# Altium schematic sheet 05_LEDs.SchDoc: ECE315 Analog
size A; Date: 4/25/2017; ApprovedBy: JSK; CheckedBy: JSK; Author: JSK; CompanyName: University of Wisconsin; DrawnBy: JSK; Engineer: JSK; Organization: ECE 315; Address1: College of Engineering; Address2: 1415 Engineering Drive; Address3: Madison, WI 53706; Address4: ECE 315 Fall 2017; Revision: A; SheetNumber: 2; SheetTotal: 2; AssemblyNumber: 0; MachineName: ECE315-S19; PCBNumber: 001; ApprovedDate: 1/17/2019
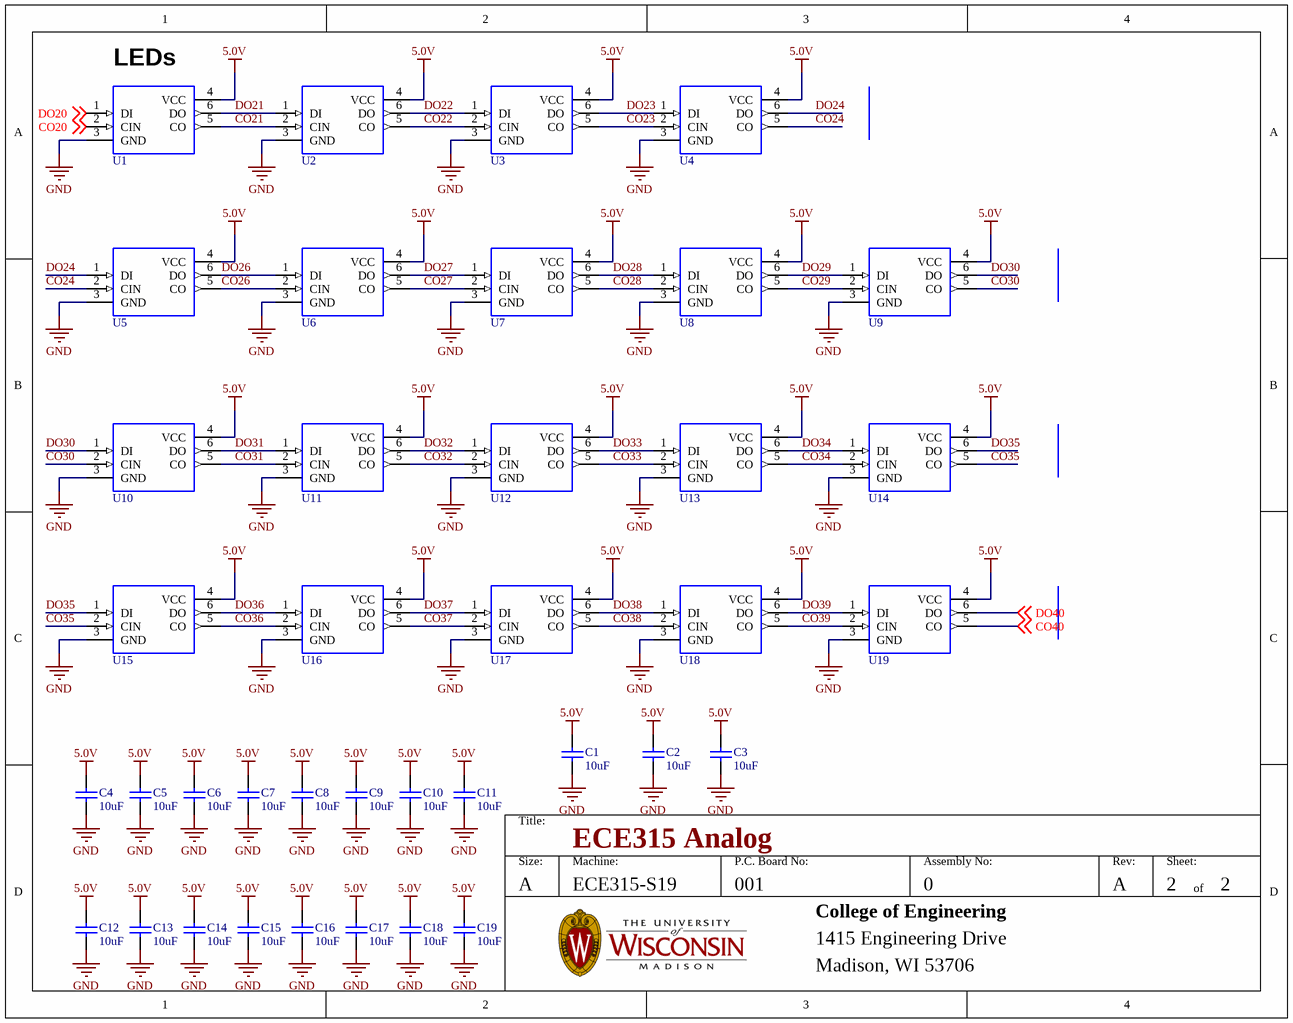
[diagram p0: 05_LEDs.SchDoc]

## Parts
C1  10uF  [CAP_0805]
C2  10uF  [CAP_0805]
C3  10uF  [CAP_0805]
C4  10uF  [CAP_0805]
C5  10uF  [CAP_0805]
C6  10uF  [CAP_0805]
C7  10uF  [CAP_0805]
C8  10uF  [CAP_0805]
C9  10uF  [CAP_0805]
C10  10uF  [CAP_0805]
C11  10uF  [CAP_0805]
C12  10uF  [CAP_0805]
C13  10uF  [CAP_0805]
C14  10uF  [CAP_0805]
C15  10uF  [CAP_0805]
C16  10uF  [CAP_0805]
C17  10uF  [CAP_0805]
C18  10uF  [CAP_0805]
C19  10uF  [CAP_0805]
U1  IC_APA102C  [APA102C]  (value not drawn)
U2  IC_APA102C  [APA102C]  (value not drawn)
U3  IC_APA102C  [APA102C]  (value not drawn)
U4  IC_APA102C  [APA102C]  (value not drawn)
U5  IC_APA102C  [APA102C]  (value not drawn)
U6  IC_APA102C  [APA102C]  (value not drawn)
U7  IC_APA102C  [APA102C]  (value not drawn)
U8  IC_APA102C  [APA102C]  (value not drawn)
U9  IC_APA102C  [APA102C]  (value not drawn)
U10  IC_APA102C  [APA102C]  (value not drawn)
U11  IC_APA102C  [APA102C]  (value not drawn)
U12  IC_APA102C  [APA102C]  (value not drawn)
U13  IC_APA102C  [APA102C]  (value not drawn)
U14  IC_APA102C  [APA102C]  (value not drawn)
U15  IC_APA102C  [APA102C]  (value not drawn)
U16  IC_APA102C  [APA102C]  (value not drawn)
U17  IC_APA102C  [APA102C]  (value not drawn)
U18  IC_APA102C  [APA102C]  (value not drawn)
U19  IC_APA102C  [APA102C]  (value not drawn)

## Nets
5.0V: C1.2 C2.2 C3.2 C4.2 C5.2 C6.2 C7.2 C8.2 C9.2 C10.2 C11.2 C12.2 C13.2 C14.2 C15.2 C16.2 C17.2 C18.2 C19.2 U1.4(VCC) U2.4(VCC) U3.4(VCC) U4.4(VCC) U5.4(VCC) U6.4(VCC) U7.4(VCC) U8.4(VCC) U9.4(VCC) U10.4(VCC) U11.4(VCC) U12.4(VCC) U13.4(VCC) U14.4(VCC) U15.4(VCC) U16.4(VCC) U17.4(VCC) U18.4(VCC) U19.4(VCC)
GND: C1.1 C2.1 C3.1 C4.1 C5.1 C6.1 C7.1 C8.1 C9.1 C10.1 C11.1 C12.1 C13.1 C14.1 C15.1 C16.1 C17.1 C18.1 C19.1 U1.3(GND) U2.3(GND) U3.3(GND) U4.3(GND) U5.3(GND) U6.3(GND) U7.3(GND) U8.3(GND) U9.3(GND) U10.3(GND) U11.3(GND) U12.3(GND) U13.3(GND) U14.3(GND) U15.3(GND) U16.3(GND) U17.3(GND) U18.3(GND) U19.3(GND)
CO20: U1.2(CIN) ; off-sheet CO20
CO21: U1.5(CO) U2.2(CIN)
CO22: U2.5(CO) U3.2(CIN)
CO23: U3.5(CO) U4.2(CIN)
CO24: U4.5(CO) U5.2(CIN)
CO26: U5.5(CO) U6.2(CIN)
CO27: U6.5(CO) U7.2(CIN)
CO28: U7.5(CO) U8.2(CIN)
CO29: U8.5(CO) U9.2(CIN)
CO30: U9.5(CO) U10.2(CIN)
CO31: U10.5(CO) U11.2(CIN)
CO32: U11.5(CO) U12.2(CIN)
CO33: U12.5(CO) U13.2(CIN)
CO34: U13.5(CO) U14.2(CIN)
CO35: U14.5(CO) U15.2(CIN)
CO36: U15.5(CO) U16.2(CIN)
CO37: U16.5(CO) U17.2(CIN)
CO38: U17.5(CO) U18.2(CIN)
CO39: U18.5(CO) U19.2(CIN)
CO40: U19.5(CO) ; off-sheet CO40
DO20: U1.1(DI) ; off-sheet DO20
DO21: U1.6(DO) U2.1(DI)
DO22: U2.6(DO) U3.1(DI)
DO23: U3.6(DO) U4.1(DI)
DO24: U4.6(DO) U5.1(DI)
DO26: U5.6(DO) U6.1(DI)
DO27: U6.6(DO) U7.1(DI)
DO28: U7.6(DO) U8.1(DI)
DO29: U8.6(DO) U9.1(DI)
DO30: U9.6(DO) U10.1(DI)
DO31: U10.6(DO) U11.1(DI)
DO32: U11.6(DO) U12.1(DI)
DO33: U12.6(DO) U13.1(DI)
DO34: U13.6(DO) U14.1(DI)
DO35: U14.6(DO) U15.1(DI)
DO36: U15.6(DO) U16.1(DI)
DO37: U16.6(DO) U17.1(DI)
DO38: U17.6(DO) U18.1(DI)
DO39: U18.6(DO) U19.1(DI)
DO40: U19.6(DO) ; off-sheet DO40

## Notes on the sheet
- (near U1) LEDs
- Title:
- Size:
- A
- Machine:
- P.C. Board No:
- Assembly No:
- Rev:
- Sheet:
- of
- College of Engineering
- 1415 Engineering Drive
- Madison, WI 53706

## Library data of the parts
C1-C19 = CAP_0805_U_010.00: CAP CER 10UF 16V X7R 0805; Manufacturer: Samsung; Manufacturer Part Number: CL21A106KPCLQNC; Tolerance: 10%; Voltage Rating: 10V; Dielectric: X5R; ComponentLink3URL: https://datasheet.ciiva.com/26920/getdatasheetpartid-355170-26920201.pdf; ComponentLink3Description: https://datasheet.ciiva.com/26920/getdatasheetpartid-355170-26920201.pdf; Supplier 1: Digi-Key; Stock 1: 40000; Pricing 1: 1=0.22, 10=0.148, 100=0.0749, 500=0.05122, 1000=0.04531 (USD); Mount: Surface Mount; Case/Package: 0805; Case Code (Metric): 2012; Case Code (Imperial): 0805; Contact Plating: Tin; Min Operating Temperature: -55°C; Max Operating Temperature: 85°C; Packaging: Tape and Reel; Package Quantity: 1; Length: 2mm; Height: 0.85mm; Width: 0.049inch; Thickness: 0.037inch; Depth: 1.25mm; Radiation Hardening: No; ComponentLink1URL: https://datasheet.ciiva.com/25730/cl21a106kpclqnc-25730594.pdf; ComponentLink1Description: https://datasheet.ciiva.com/25730/cl21a106kpclqnc-25730594.pdf; Supplier Part Number 1: 1276-2402-1-ND; Capacitance: 10uF
U1-U19 = IC_APA102C: APA102C LED